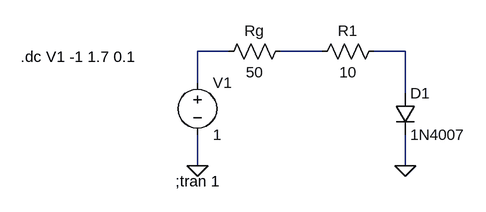
[diagram p0: schematic simulacion_diodo.asc]
simulacion_diodo.asc, the LTspice schematic file:
Version 4
SHEET 1 880 680
WIRE 64 128 16 128
WIRE 208 128 144 128
WIRE 336 128 288 128
WIRE 16 176 16 128
WIRE 336 192 336 128
WIRE 16 304 16 256
WIRE 336 304 336 256
FLAG 16 304 0
FLAG 336 304 0
SYMBOL res 160 112 R90
WINDOW 0 0 56 VBottom 2
WINDOW 3 32 56 VTop 2
SYMATTR InstName Rg
SYMATTR Value 50
SYMBOL res 304 112 R90
WINDOW 0 0 56 VBottom 2
WINDOW 3 32 56 VTop 2
SYMATTR InstName R1
SYMATTR Value 10
SYMBOL voltage 16 160 R0
WINDOW 123 0 0 Left 2
WINDOW 39 0 0 Left 2
SYMATTR InstName V1
SYMATTR Value 1
SYMBOL diode 320 192 R0
SYMATTR InstName D1
SYMATTR Value 1N4007
TEXT -18 328 Left 2 !;tran 1
TEXT -256 136 Left 2 !.dc V1 -1 1.7 0.1

The netlist it stands for:
* simulacion_diodo.asc
Rg N002 N001 50
R1 N003 N002 10
V1 N001 0 1
D1 N003 0 1N4007
.model D D
.lib standard.dio
;tran 1
.dc V1 -1 1.7 0.1
.backanno
.end